# Altium schematic sheet tscnew-tr-3-8-asadi.SchDoc
size A3
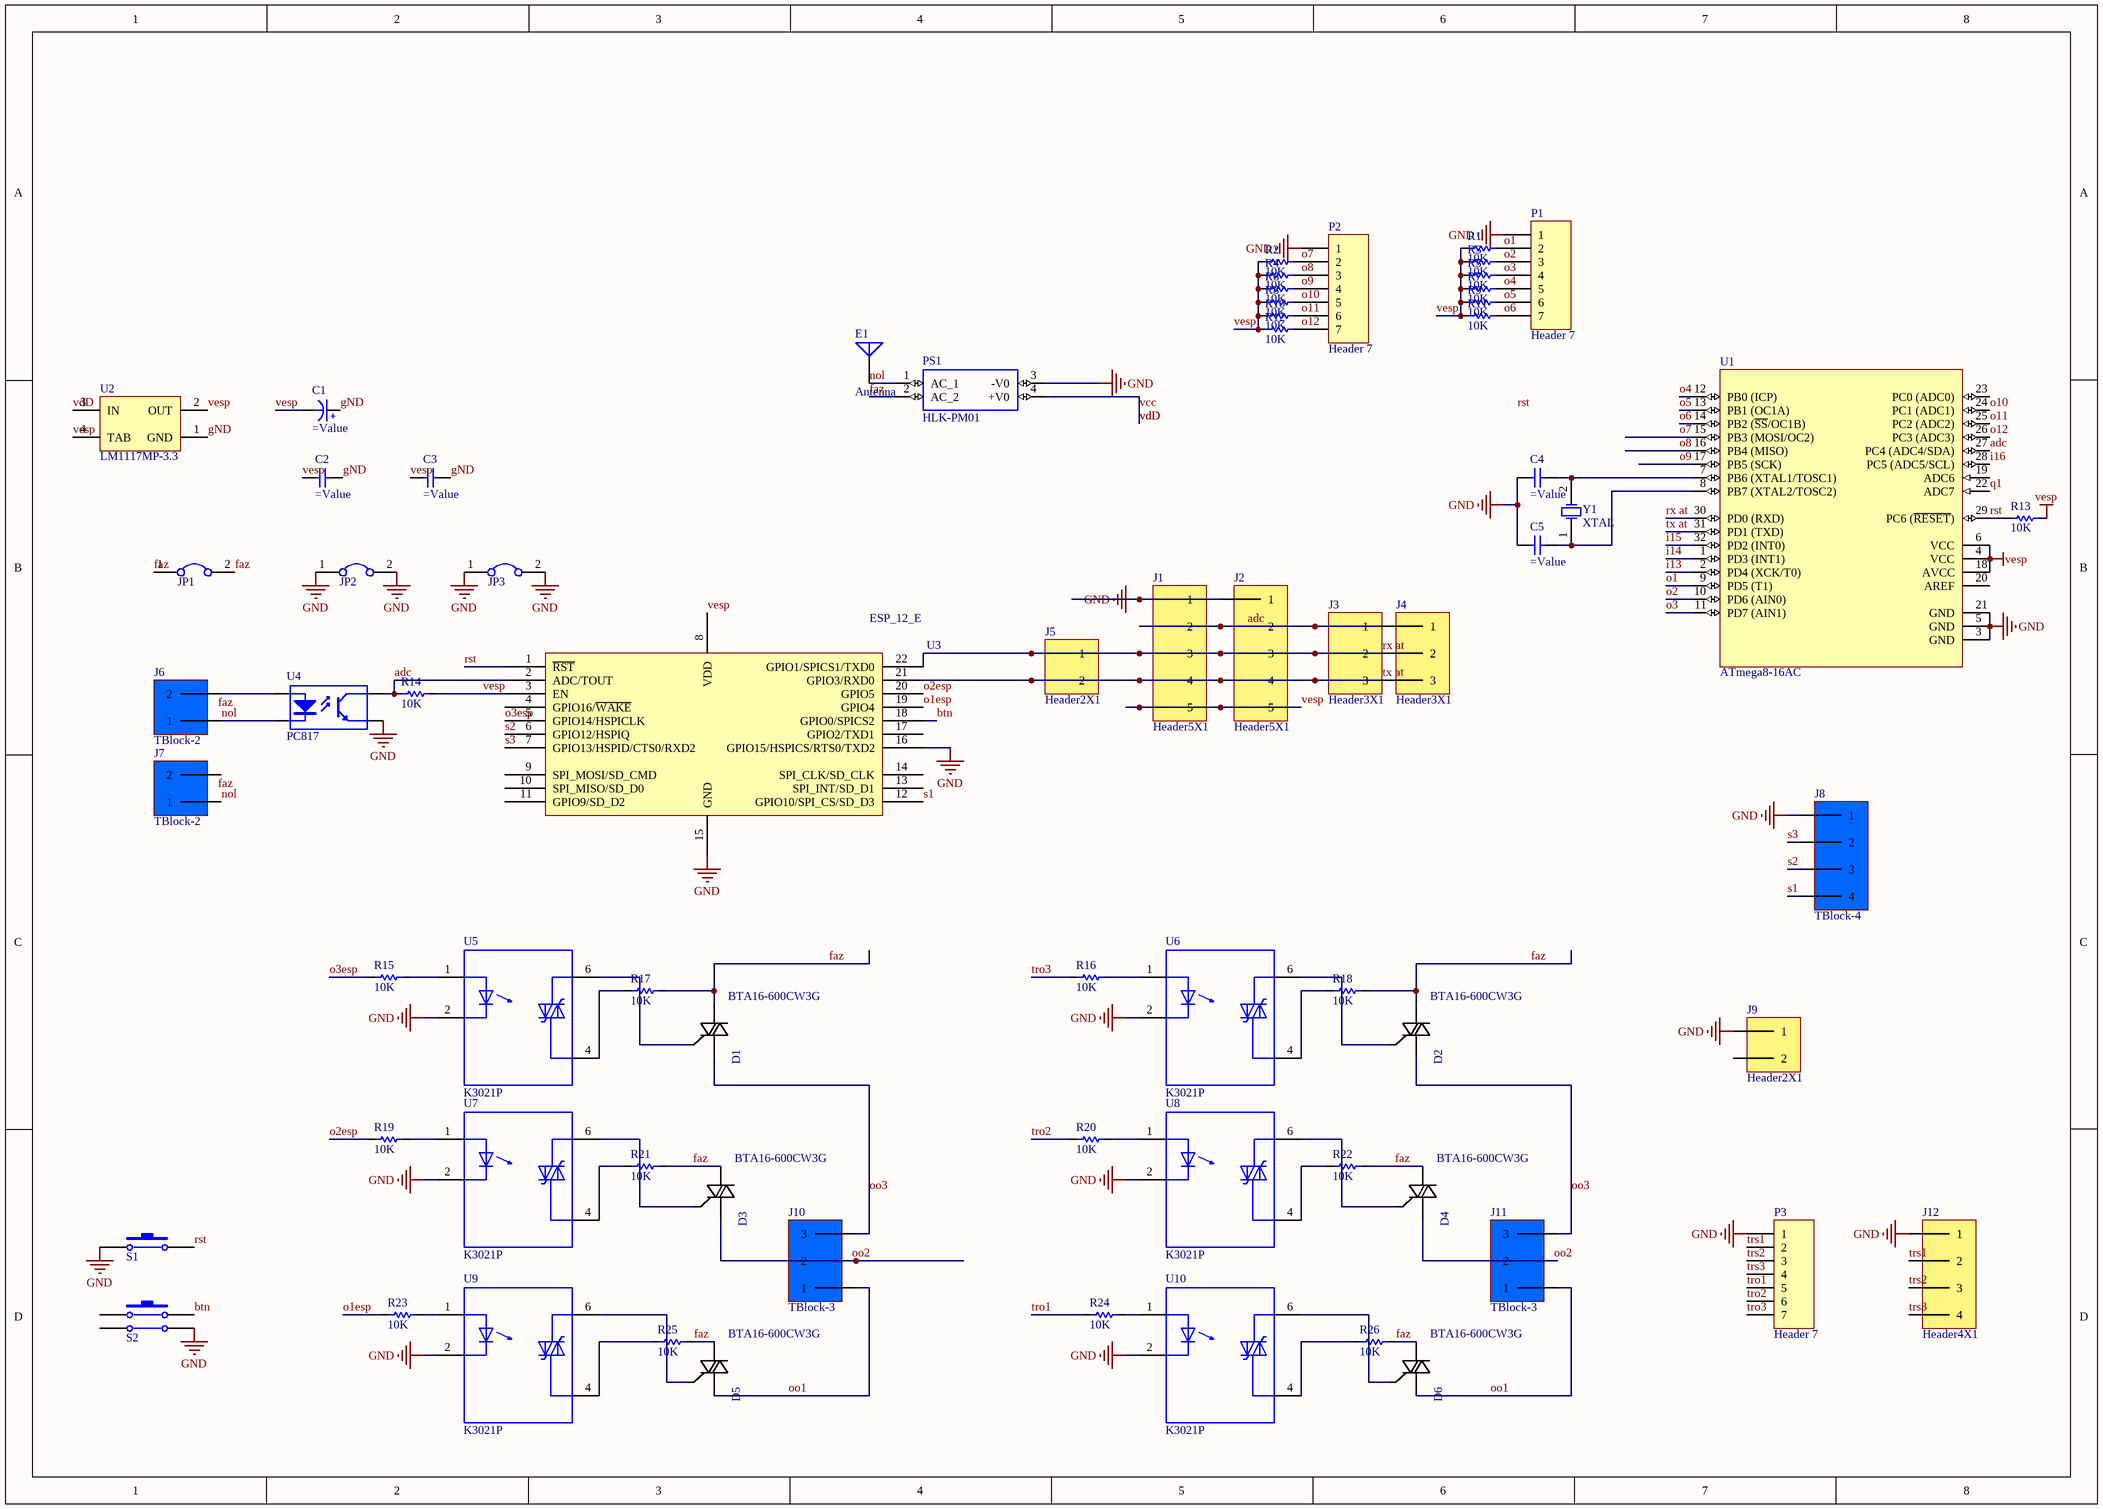
[diagram p0: tscnew-tr-3-8-asadi.SchDoc]

## Parts
C1  (no value)  [ELEC-CAP-RAD10-20]
C2  (no value)  [CAP 0805]
C3  (no value)  [CAP 1206]
C4  (no value)  [CAP 0805]
C5  (no value)  [CAP 0805]
D1  BTA16-600CW3G  [*TO254P1028X482X1968-3]
D2  BTA16-600CW3G  [*TO254P1028X482X1968-3]
D3  BTA16-600CW3G  [*TO254P1028X482X1968-3]
D4  BTA16-600CW3G  [*TO254P1028X482X1968-3]
D5  BTA16-600CW3G  [*TO254P1028X482X1968-3]
D6  BTA16-600CW3G  [*TO254P1028X482X1968-3]
E1  Antenna  [PIN1]
J1  Header5X1  [HEADER 5X1]
J2  Header5X1  [HEADER 5X1]
J3  Header3X1  [HEADER 3X1]
J4  Header3X1  [HEADER 3X1]
J5  Header2X1  [Header 2X1]
J6  TBlock-2  [KF300-2 PIN]
J7  TBlock-2  [KF300-2 PIN]
J8  TBlock-4  [KF300-4 PIN]
J9  Header2X1  [Header 2X1]
J10  TBlock-3  [KF300-3 PIN]
J11  TBlock-3  [KF300-3 PIN]
J12  Header4X1  [HEADER 4X1]
JP1  Jumper  [Header 2X1]  (value not drawn)
JP2  Jumper  [Header 2X1]  (value not drawn)
JP3  Jumper  [Header 2X1]  (value not drawn)
P1  Header 7  [HDR1X7]
P2  Header 7  [HDR1X7]
P3  Header 7  [HDR1X7]
PS1  HLK-PM01  [HLKPM01]
R1  10K  [RES 0805 (2012X06L)]
R2  10K  [RES 0805 (2012X06L)]
R3  10K  [RES 0805 (2012X06L)]
R4  10K  [RES 0805 (2012X06L)]
R5  10K  [RES 0805 (2012X06L)]
R6  10K  [RES 0805 (2012X06L)]
R7  10K  [RES 0805 (2012X06L)]
R8  10K  [RES 0805 (2012X06L)]
R9  10K  [RES 0805 (2012X06L)]
R10  10K  [RES 0805 (2012X06L)]
R11  10K  [RES 0805 (2012X06L)]
R12  10K  [RES 0805 (2012X06L)]
R13  10K  [RES 1206 (3216X08L)]
R14  10K  [RES 0805 (2012X06L)]
R15  10K  [RES 1206 (3216X08L)]
R16  10K  [RES 1206 (3216X08L)]
R17  10K  [RES 1206 (3216X08L)]
R18  10K  [RES 1206 (3216X08L)]
R19  10K  [RES 1206 (3216X08L)]
R20  10K  [RES 1206 (3216X08L)]
R21  10K  [RES 1206 (3216X08L)]
R22  10K  [RES 1206 (3216X08L)]
R23  10K  [RES 1206 (3216X08L)]
R24  10K  [RES 1206 (3216X08L)]
R25  10K  [RES 1206 (3216X08L)]
R26  10K  [RES 1206 (3216X08L)]
S1  PB-2pin  [PB-2pin]  (value not drawn)
S2  PUSH BUTTON DOUBLE  [PUSH BUTTON]  (value not drawn)
U1  ATmega8-16AC  [32A_N]
U2  LM1117MP-3.3  [MP04A_N]
U3  ESP_12_E  [ESP_12_E]
U4  PC817  [DIP4]
U5  K3021P  [DIP762W50P254L730H410Q6]
U6  K3021P  [DIP762W50P254L730H410Q6]
U7  K3021P  [DIP762W50P254L730H410Q6]
U8  K3021P  [DIP762W50P254L730H410Q6]
U9  K3021P  [DIP762W50P254L730H410Q6]
U10  K3021P  [DIP762W50P254L730H410Q6]
Y1  XTAL  [R38]

## Nets
gND: C1.2(+) C2.2(-) C3.2(-) C4.1(+) C5.1(+) J1.1 J2.1 J8.1 J9.1 J12.1 JP2.1 JP2.2 JP3.1 JP3.2 P1.1 P2.1 P3.1 PS1.3(-V0) S1.1 S2.4 U1.3(GND) U1.5(GND) U1.21(GND) U2.1(GND) U3.15(GND) U3.16(GPIO15/HSPICS/RTS0/TXD2) U4.3(E) U5.2(C) U6.2(C) U7.2(C) U8.2(C) U9.2(C) U10.2(C)
vesp: C1.1(-) C2.1(+) C3.1(+) J1.5 J2.5 R1.2 R2.2 R3.2 R4.2 R5.2 R6.2 R7.2 R8.2 R9.2 R10.2 R11.2 R12.2 R13.2 R14.1 U1.4(VCC) U1.6(VCC) U1.18(AVCC) U2.2(OUT) U2.4(TAB) U3.3(EN) U3.8(VDD)
adc: J1.2 J2.2 J3.1 J4.1 R14.2 U1.27(PC4_(ADC4/SDA)) U3.2(ADC/TOUT) U4.4(C)
btn: S2.2 U3.18(GPIO0/SPICS2)
faz: D1.2(MT2) D2.2(MT2) D3.2(MT2) D4.2(MT2) D5.2(MT2) D6.2(MT2) J6.2 JP1.1 JP1.2 PS1.2(AC_2) R17.2 R18.2 R21.2 R22.2 R25.2 R26.2 U4.1(A)
i13: U1.2(PD4_(XCK/T0))
i14: U1.1(PD3_(INT1))
i15: U1.32(PD2_(INT0))
i16: U1.28(PC5_(ADC5/SCL))
nol: E1.1(A) J6.1 J7.1 PS1.1(AC_1) U4.2(K)
o1: P1.2 R1.1 U1.9(PD5_(T1))
o1esp: R23.1 U3.19(GPIO4)
o2: P1.3 R3.1 U1.10(PD6_(AIN0))
o2esp: R19.1 U3.20(GPIO5)
o3: P1.4 R5.1 U1.11(PD7_(AIN1))
o3esp: R15.1 U3.5(GPIO14/HSPICLK)
o4: P1.5 R7.1 U1.12(PB0_(ICP))
o5: P1.6 R9.1 U1.13(PB1_(OC1A))
o6: P1.7 R11.1 U1.14(PB2_(~{SS}/OC1B))
o7: P2.2 R2.1 U1.15(PB3_(MOSI/OC2))
o8: P2.3 R4.1 U1.16(PB4_(MISO))
o9: P2.4 R6.1 U1.17(PB5_(SCK))
o10: P2.5 R8.1 U1.24(PC1_(ADC1))
o11: P2.6 R10.1 U1.25(PC2_(ADC2))
o12: P2.7 R12.1 U1.26(PC3_(ADC3))
oo1: D5.1(MT1) D6.1(MT1) J10.1 J11.1
oo2: D3.1(MT1) D4.1(MT1) J10.2 J11.2
oo3: D1.1(MT1) D2.1(MT1) J10.3 J11.3
q1: U1.22(ADC7)
rst: R13.1 S1.2 U1.29(PC6_(~{RESET})) U3.1(~{RST})
rx at: J1.3 J2.3 J3.2 J4.2 J5.1 U1.30(PD0_(RXD)) U3.22(GPIO1/SPICS1/TXD0)
s1: J8.4 U3.12(GPIO10/SPI_CS/SD_D3)
s2: J8.3 U3.6(GPIO12/HSPIQ)
s3: J8.2 U3.7(GPIO13/HSPID/CTS0/RXD2)
tro1: P3.5 R24.1
tro2: P3.6 R20.1
tro3: P3.7 R16.1
trs1: J12.2 P3.2
trs2: J12.3 P3.3
trs3: J12.4 P3.4
tx at: J1.4 J2.4 J3.3 J4.3 J5.2 U1.31(PD1_(TXD)) U3.21(GPIO3/RXD0)
vcc: PS1.4(+V0) U2.3(IN)  [also labelled vdD]
NetC4_2: C4.2(-) U1.7(PB6_(XTAL1/TOSC1)) Y1.2(OSC2)
NetC5_2: C5.2(-) U1.8(PB7_(XTAL2/TOSC2)) Y1.1(OSC1)
NetD1_3: D1.3(G) U5.6(MT2)
NetD2_3: D2.3(G) U6.6(MT2)
NetD3_3: D3.3(G) U7.6(MT2)
NetD4_3: D4.3(G) U8.6(MT2)
NetD5_3: D5.3(G) U9.6(MT2)
NetD6_3: D6.3(G) U10.6(MT2)
NetR15_2: R15.2 U5.1(A)
NetR16_2: R16.2 U6.1(A)
NetR17_1: R17.1 U5.4(MT1)
NetR18_1: R18.1 U6.4(MT1)
NetR19_2: R19.2 U7.1(A)
NetR20_2: R20.2 U8.1(A)
NetR21_1: R21.1 U7.4(MT1)
NetR22_1: R22.1 U8.4(MT1)
NetR23_2: R23.2 U9.1(A)
NetR24_2: R24.2 U10.1(A)
NetR25_1: R25.1 U9.4(MT1)
NetR26_1: R26.1 U10.4(MT1)

Not connected (* = marked no-connect by the designer): J7 2; J9 2; S2 1 3; U1 19(ADC6) 20(AREF) 23(PC0_(ADC0)); U3 4(GPIO16/~{WAKE}) 9(SPI_MOSI/SD_CMD) 10(SPI_MISO/SD_D0) 11(GPIO9/SD_D2) 13(SPI_INT/SD_D1) 14(SPI_CLK/SD_CLK) 17(GPIO2/TXD1)

## Notes on the sheet
- Labels drawn without touching a wire or pin: faz, rst

## Library data of the parts
C1 = Capacitor Electrolytic: Electrolytic Capacitor
C2-C5 = Capacitor
D1-D6 = BTA16-600CW3G: TRIAC Standard 600V 16A Through Hole TO-220AB; MF: Littelfuse Inc.; Package: TO-220 ON Semiconductor; SnapEDA_Link: https://www.snapeda.com/parts/BTA16-600CW3G/Littelfuse%20Inc./view-part/390940/?ref=snap; Mouser-Purchase-URL: https://snapeda.com/shop?store=Mouser&id=390940; DigiKey-Purchase-URL: https://snapeda.com/shop?store=DigiKey&id=390940; Price: None; Arrow_Americas-Purchase-URL: https://snapeda.com/shop?store=Arrow+Americas&id=390940; Availability: Unavailable; MP: BTA16-600CW3G; Value: *
E1 = Antenna: Generic Antenna; Published: 24-Mar-1999; LatestRevisionDate: 17-Jul-2002; LatestRevisionNote: Re-released for DXP Platform.; PackageReference: PIN1; Publisher: Altium Limited
P1-P3 = Header 7: Header, 7-Pin; LatestRevisionDate: 17-Jul-2002; LatestRevisionNote: Re-released for DXP Platform.; Publisher: Altium Limited
PS1 = HLK-PM01: <b>Ultra-compact power module</b><p> Source: <a href="https://datasheet.lcsc.com/szlcsc/1906201102_HI-LINK-HLK-PM03_C209904.pdf"> Datasheet </a>; Package: Package Analog Devices; MF: Hi-link; Availability: Unavailable; Value: *; MP: hlk-pm01; Price: None; SnapEDA_Link: https://www.snapeda.com/parts/hlk-pm01/Hi-link/view-part/2875605/?ref=snap
R1-R26 = Resistor: Tolerance: 5%; Power: 1/4 W; Value: 10K
S1 = PB-2pin: Switch; E-mail: picpars@gmail.com; Designer: Seyed Mohsen Ghasemian; Publisher: www.picpars.com; WEB: www.picpars.com
S2 = PUSH BUTTON DOUBLE: Switch
U1 = ATmega8-16AC: 8-Bit AVR Microcontroller with 8K Bytes of In-System Programmable Flash Memory; Published: 17-Sep-2003; LatestRevisionDate: 16-Oct-2006; LatestRevisionNote: IPC-7351 Footprint Added.; DatasheetVersion: 2486H-AVR-09/02; PackageVersion: revB, Oct-2001; PackageReference: 32A; Publisher: Altium Limited; PackageDescription: 32-Lead, 7x7x1.0 mm Body, 0.8mm Lead Pitch, Thin Profile Plastic Quad Flat Package (TQFP); Supplier 1: Digi-Key; Supplier Part Number 1: ATMEGA8-16AC-ND; Supplier 2: Mouser; Supplier Part Number 2: 556-ATMEGA8-16AC; Code_JEDEC: MS-026-ABA; ComponentLink1Description: Datasheet; ComponentLink1URL: http://www.atmel.com/dyn/resources/prod_documents/doc2486.pdf; ComponentLink2Description: Atmel.com Home; ComponentLink2URL: http://www.atmel.com
U2 = LM1117MP-3.3: 800mA Low-Dropout Linear Regulator; Manufacturer: National Semiconductor; CompType: LDO IC; PackageTopMarking: XYTT*N05A; PowerWise: N; Published: 4-Dec-2008; DatasheetVersion: Apr-2006; PackageVersion: revB, Apr-2003; PackageReference: MP04A; Publisher: Altium Limited; PackageDescription: Molded SOT-223, 6.50 x 3.56 x 1.6mm Body, 4 Lead, 2.3mm Pitch; PartNumber: LM1117MP-3.3; RoHS: O; PinCount: 4; DigiKeyPartNumber: LM1117MP-3.3CT-ND; Code_JEDEC: TO-261-AA; Code_IPC: SOT223-4; ComponentLink1Description: LM1117 Datasheet; ComponentLink1URL: http://www.national.com/ds/LM/LM1117.pdf; ComponentLink2Description: LM1117 Web Page; ComponentLink2URL: http://www.national.com/pf/LM/LM1117.html; ComponentLink3Description: MP04A Package Page; ComponentLink3URL: http://www.national.com/packaging/folders/mp04a.html
U3 = ESP_12_E: ESP-12 Wi-Fi Module by AI-Thinker; IC: ESP8266-EX; Vendor: Ai-thinker
U4 = OPTCOUPLER_01: 4-Pin Phototransistor Optocoupler
U5-U10 = K3021P: Optoisolator Triac Output 5300Vrms 1 Channel 6-DIP; MF: Vishay Semiconductor; Package: DIP-6 Vishay; Availability: Unavailable; Value: *; MP: K3021P; Mouser-Purchase-URL: https://snapeda.com/shop?store=Mouser&id=291595; SnapEDA_Link: https://www.snapeda.com/parts/K3021P/Vishay%20Semiconductor%20Opto%20Division/view-part/291595/?ref=snap; Price: None; DigiKey-Purchase-URL: https://snapeda.com/shop?store=DigiKey&id=291595
Y1 = XTAL: Crystal Oscillator; Published: 8-Jun-2000; LatestRevisionDate: 17-Jul-2002; LatestRevisionNote: Re-released for DXP Platform.; PackageReference: R38; Publisher: Altium Limited; PackageDescription: Crystal, Thru-Hole; 2 Leads; Body 3.1 x 8.2 mm (Dia.xH)